# EasyEDA schematic LcsNodes-Building-Block-RailCom-Detector.json
TITLE: RailCom Detector; REV: 1.0; Date: 2022-09-19; Sheet: 1/1; Drawn By: helmut-f; Company: Your Company
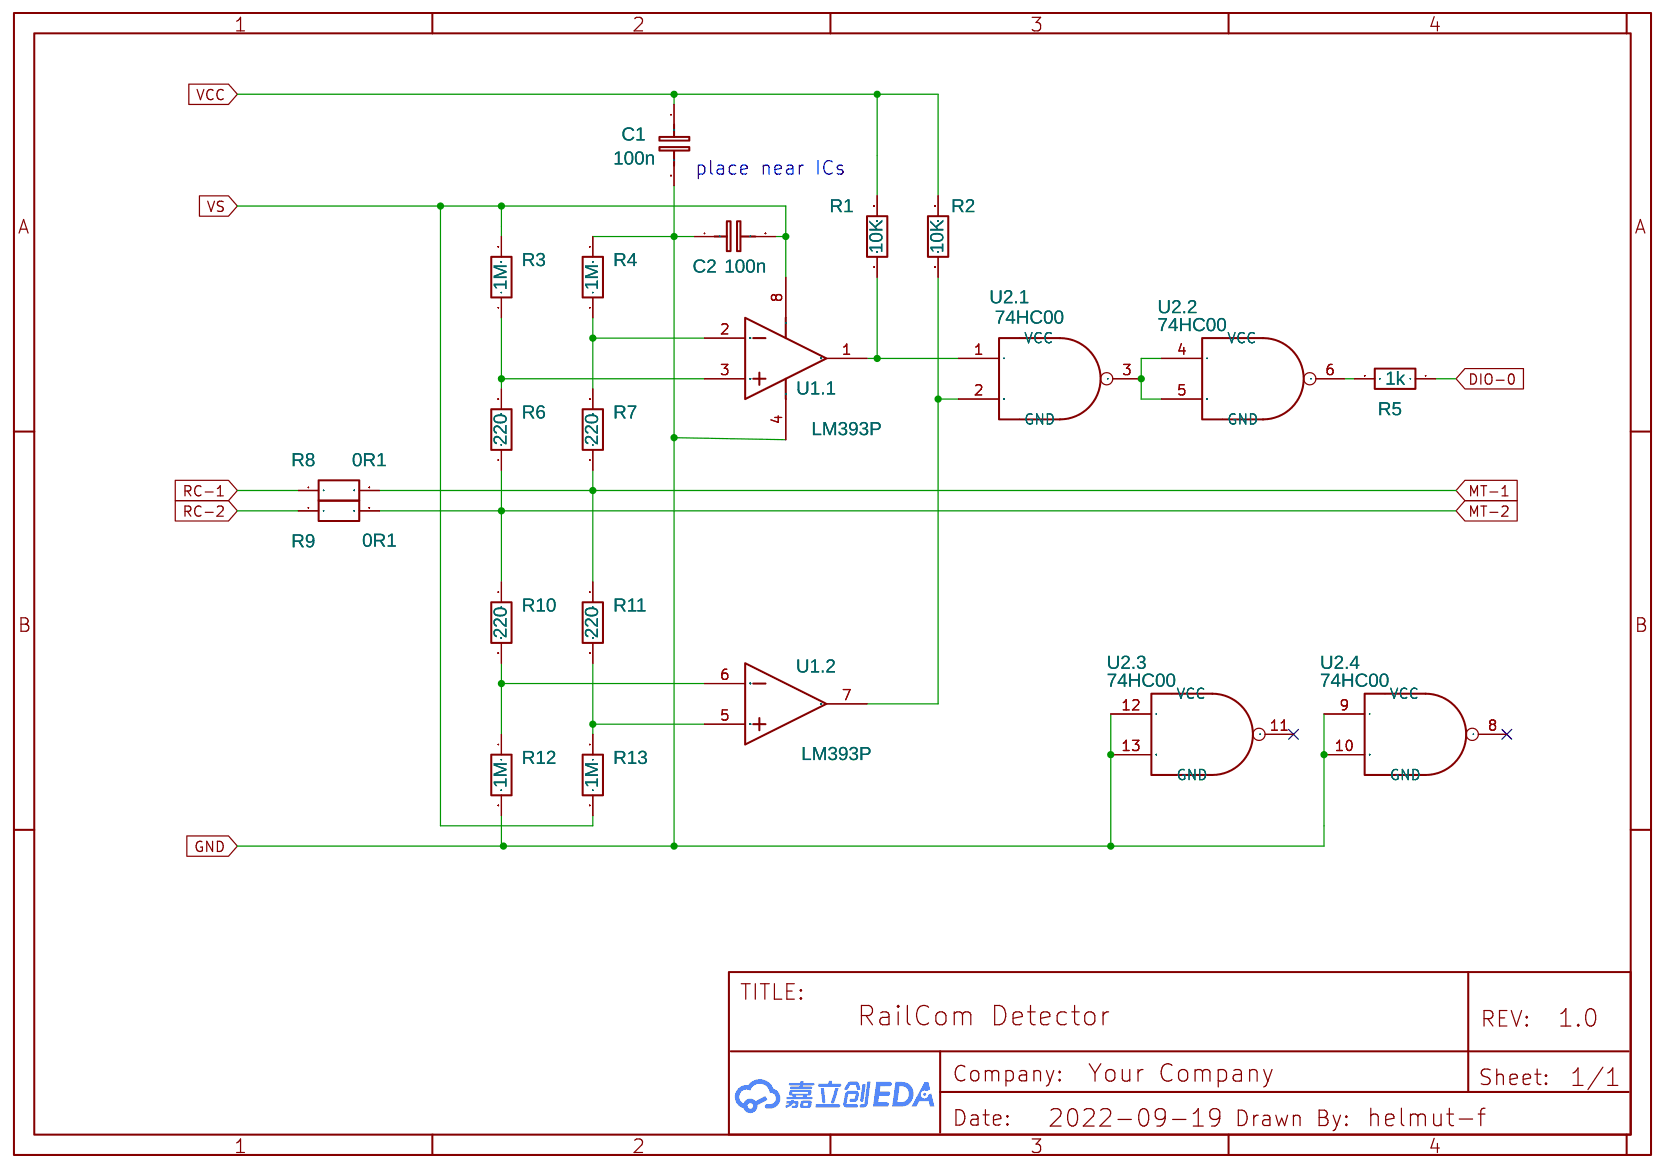
[diagram p0: schematic sheet]

## Parts
C1  100n  [RAD-0.1]
C2  100n  [RAD-0.1]
R1  10K  [R_AXIAL-0.3]
R2  10K  [R_AXIAL-0.3]
R3  1M  [R_AXIAL-0.3]
R4  1M  [R_AXIAL-0.3]
R5  1k  [R_AXIAL-0.3]
R6  220  [R_AXIAL-0.3]
R7  220  [R_AXIAL-0.3]
R8  0R1  [L_AXIAL-0.4]
R9  0R1  [L_AXIAL-0.4]
R10  220  [R_AXIAL-0.3]
R11  220  [R_AXIAL-0.3]
R12  1M  [R_AXIAL-0.3]
R13  1M  [R_AXIAL-0.3]
U1  LM393P  [DIP-8_L10.1-W6.3-P2.54-LS7.6-BL]  (sections 1,2)
U2  74HC00  [PDIP-14_L19.2-W6.4-P2.54-LS8.0-BL]  (sections 1,2,3,4)

## Library data of the parts
C1 C2 = C_0603_EU: Contributor: LCEDA_Lib; Package Display: No
R1-R13 = R_AXIAL-0.3_EU: Contributor: LCEDA_Lib
U1 = LM393P: Supplier: LCSC; Manufacturer: TI; image: //image.lceda.cn/szlcsc/C5209.jpg; Supplier Part: C5209; subpart_no: 1
U2 = 74HC00: Contributor: David EL; subpart_no: 1; Package Display: No; Supplier: LCSC

## Nets
GND: C1.2 C2.1 R4.2 R12.2 U1.4(GND) U2.9(A) U2.10(B) U2.12(A) U2.13(B)
VCC: C1.1 R1.2 R2.2
DIO-0: R5.1
MT-1: R7.1 R8.2 R11.1
MT-2: R6.1 R9.2 R10.1
RC-1: R8.1
RC-2: R9.1
VS: C2.2 R3.2 R13.2 U1.8(VCC)
Net-(R1-1): R1.1 U1.1(1OUT) U2.1(A)
Net-(R2-1): R2.1 U1.7(2OUT) U2.2(B)
Net-(R3-1): R3.1 R6.2 U1.3(1IN+)
Net-(R4-1): R4.1 R7.2 U1.2(1IN-)
Net-(R5-2): R5.2 U2.6(Y)
Net-(R10-2): R10.2 R12.1 U1.6(2IN-)
Net-(R11-2): R11.2 R13.1 U1.5(2IN+)
Net-(U2.1-3): U2.3(Y) U2.4(A) U2.5(B)

Not connected (* = marked no-connect by the designer): U2 7(GND) 8(Y)* 11(Y)* 14(VCC)

## Notes on the sheet
- place near ICs
